# Altium schematic sheet LPCB234 - SHUNT SENSOR.SchDoc
size A3; Address1: Factory 10; Address2: 9-13 Dingley Avenue, Dandeong, VICTORIA 3175, AUSTRALIA; Revision: 1; SheetNumber: 1; SheetTotal: ?; Lockie__PCB_SUB_ASSEMBLY: PCB Sub Component; Lockie__PCB_ASSEMBLY: PCB Assembly; Lockie__LDL: LPCBxxx; Lockie__PCB_DESCRIPTION: PCB Description
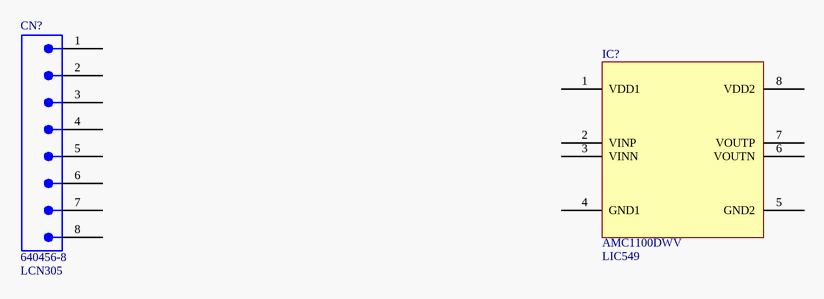
[diagram p0: LPCB234 - SHUNT SENSOR.SchDoc]

## Parts
CN?  640456-8  LDL_NUMBER: LCN305  [640456-8]
IC?  AMC1100DWV  LDL_NUMBER: LIC549  [LFP116__R-PDSO-G8]

## Nets

Not connected (* = marked no-connect by the designer): CN? 1 2 3 4 5 6 7 8; IC? 1(VDD1) 2(VINP) 3(VINN) 4(GND1) 5(GND2) 6(VOUTN) 7(VOUTP) 8(VDD2)

## Notes on the sheet
- PCB COMPONENT DESCRIPTION
- LDL NUMBER
- Assembly Details
- Size
- Drawing File Name
- Revision
- http://sil3.com.au
  ACN: 123 529 064
  Factory 10
  9-13 Dingley Avenue
  Dandenong, VICTORIA
  Australia
- Scale
- A3
- Sheet Details
- N.T.S
- Sheet:
- Of:

## Library data of the parts
CN? = 640456-8: Connector, Male Header, 8 Way; FMEDA__CHANNEL: COM; FMEDA__OPERATING__CURRENT_MAX: 0; FMEDA__OPERATING__TEMP_MAX: 50; FMEDA__OPERATING__TEMP_MIN: -20; FMEDA__OPERATING__TEMP_TYP: 27; FMEDA__OPERATING__VOLTAGE_MAX: 16; FMEDA__OPERATING__VOLTAGE_TYP: 12; FMEDA__FUNCTION_IN_SYSTEM: *; FMEDA__OPERATING__CURRENT_MIN: 0; FMEDA__OPERATING__CURRENT_TYP: 0; FMEDA__OPERATING__VOLTAGE_MIN: 0
IC? = AMC1100DWV: IC, Isolation Amplifier, SMD SOIC8 [LIC549]